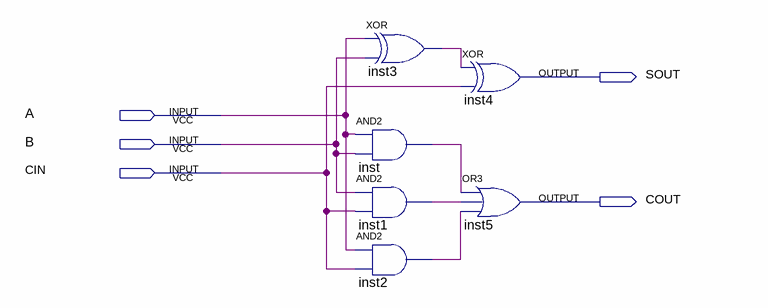
[diagram p0: schematic sheet]
// Quartus schematic myfulladdSCH.bdf as structural Verilog: 6 symbols, 5 pins
module myfulladdSCH (
  input  A,
  input  B,
  input  CIN,
  output SOUT,
  output COUT
);

  wire inst1_out, inst2_out, inst3_out, inst_out;

  xor inst3 (inst3_out, A, B);
  and inst (inst_out, A, B);
  and inst1 (inst1_out, B, CIN);
  and inst2 (inst2_out, A, CIN);
  xor inst4 (SOUT, inst3_out, CIN);
  or inst5 (COUT, inst_out, inst1_out, inst2_out);
endmodule
